# Altium schematic sheet Arena2.0.SchDoc
size A4
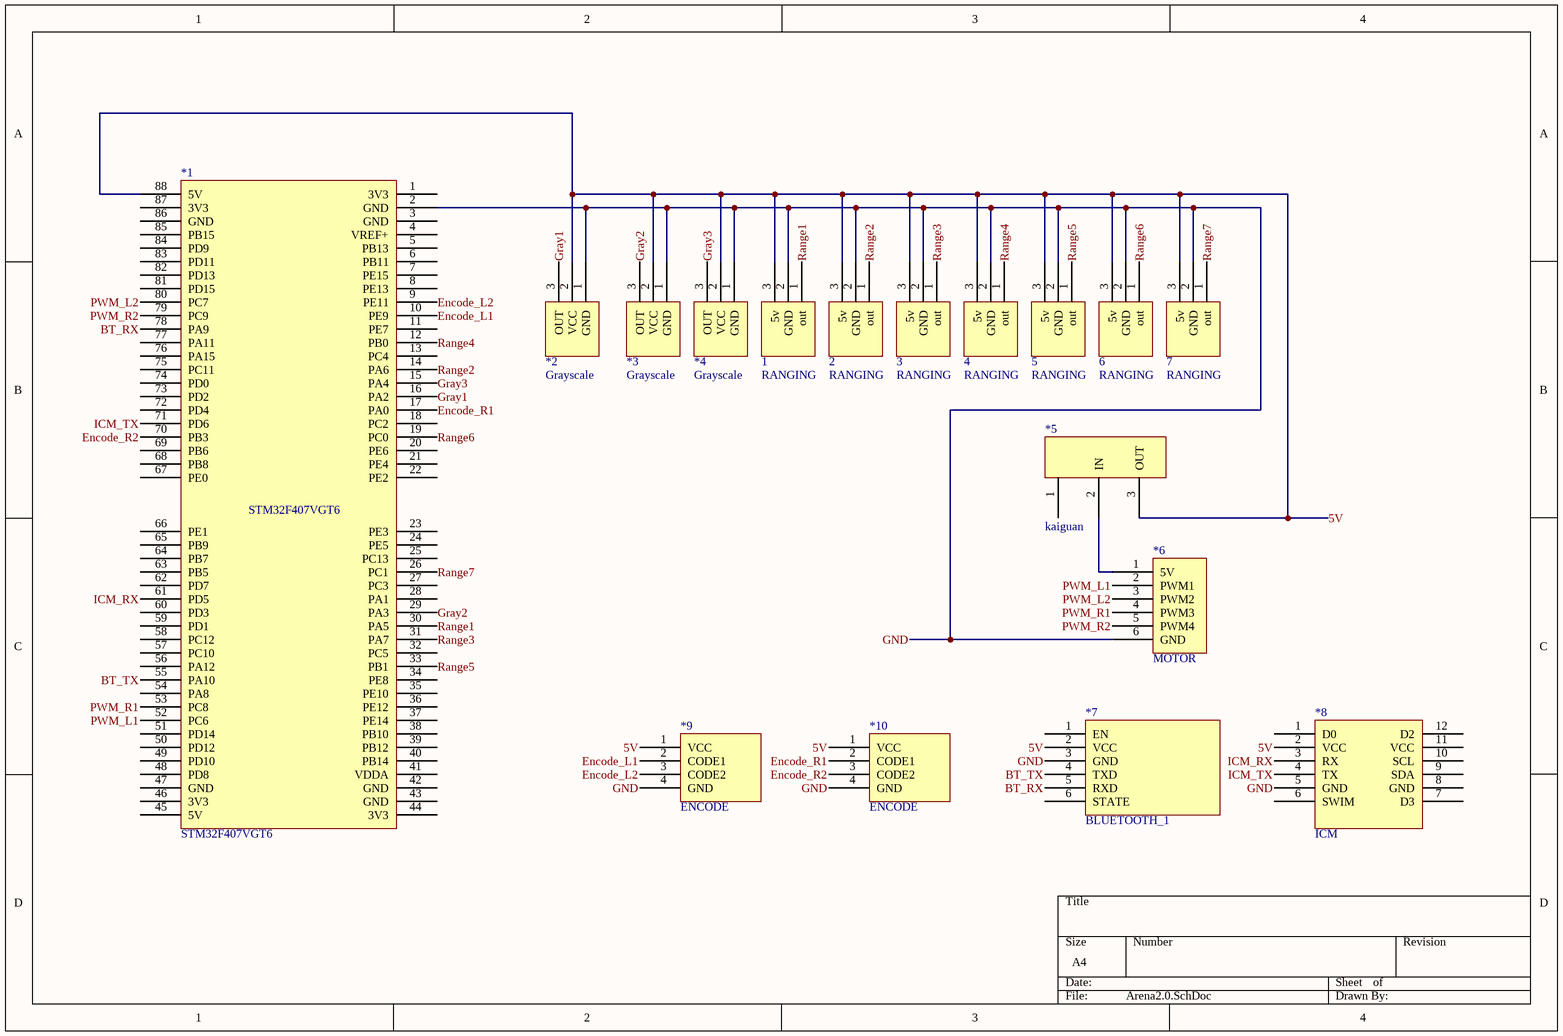
[diagram p0: Arena2.0.SchDoc]

## Parts
1  RANGING  [PH2.0-L-Z-3P]
2  RANGING  [PH2.0-L-Z-3P]
3  RANGING  [PH2.0-L-Z-3P]
4  RANGING  [PH2.0-L-Z-3P]
5  RANGING  [PH2.0-L-Z-3P]
6  RANGING  [PH2.0-L-Z-3P]
7  RANGING  [PH2.0-L-Z-3P]
*1  STM32F407VGT6  [STM32F407VGT6]
*2  Grayscale  [PH2.0-L-Z-3P]
*3  Grayscale  [PH2.0-L-Z-3P]
*4  Grayscale  [PH2.0-L-Z-3P]
*5  kaiguan  [kaiguan]
*6  MOTOR  [PH2.0-L-Z-6P]
*7  BLUETOOTH_1  [bluetooth]
*8  ICM  [ICM]
*9  ENCODE  [PH2.0-L-Z-4P]
*10  ENCODE  [PH2.0-L-Z-4P]

## Nets
5V: 1.3(5v) 2.3(5v) 3.3(5v) 4.3(5v) 5.3(5v) 6.3(5v) 7.3(5v) *1.88(5V) *2.2(VCC) *3.2(VCC) *4.2(VCC) *5.3(OUT) *7.2(VCC) *8.2(VCC) *9.1(VCC) *10.1(VCC)
BT_RX: *1.78(PA9) *7.5(RXD)
BT_TX: *1.55(PA10) *7.4(TXD)
Encode_L1: *1.10(PE9) *9.2(CODE1)
Encode_L2: *1.9(PE11) *9.3(CODE2)
Encode_R1: *1.17(PA0) *10.2(CODE1)
Encode_R2: *1.70(PB3) *10.3(CODE2)
GND: 1.2(GND) 2.2(GND) 3.2(GND) 4.2(GND) 5.2(GND) 6.2(GND) 7.2(GND) *1.2(GND) *2.1(GND) *3.1(GND) *4.1(GND) *6.6(GND) *7.3(GND) *8.5(GND) *9.4(GND) *10.4(GND)
Gray1: *1.16(PA2) *2.3(OUT)
Gray2: *1.29(PA3) *3.3(OUT)
Gray3: *1.15(PA4) *4.3(OUT)
ICM_RX: *1.61(PD5) *8.3(RX)
ICM_TX: *1.71(PD6) *8.4(TX)
PWM_L1: *1.52(PC6) *6.2(PWM1)
PWM_L2: *1.80(PC7) *6.3(PWM2)
PWM_R1: *1.53(PC8) *6.4(PWM3)
PWM_R2: *1.79(PC9) *6.5(PWM4)
Range1: 1.1(out) *1.30(PA5)
Range2: 2.1(out) *1.14(PA6)
Range3: 3.1(out) *1.31(PA7)
Range4: 4.1(out) *1.12(PB0)
Range5: 5.1(out) *1.33(PB1)
Range6: 6.1(out) *1.19(PC0)
Range7: 7.1(out) *1.26(PC1)
Net*5_2: *5.2(IN) *6.1(5V)

Not connected (* = marked no-connect by the designer): *1 1(3V3) 3(GND) 4(VREF+) 5(PB13) 6(PB11) 7(PE15) 8(PE13) 11(PE7) 13(PC4) 18(PC2) 20(PE6) 21(PE4) 22(PE2) 23(PE3) 24(PE5) 25(PC13) 27(PC3) 28(PA1) 32(PC5) 34(PE8) 35(PE10) 36(PE12) 37(PE14) 38(PB10) 39(PB12) 40(PB14) 41(VDDA) 42(GND) 43(GND) 44(3V3) 45(5V) 46(3V3) 47(GND) 48(PD8) 49(PD10) 50(PD12) 51(PD14) 54(PA8) 56(PA12) 57(PC10) 58(PC12) 59(PD1) 60(PD3) 62(PD7) 63(PB5) 64(PB7) 65(PB9) 66(PE1) 67(PE0) 68(PB8) 69(PB6) 72(PD4) 73(PD2) 74(PD0) 75(PC11) 76(PA15) 77(PA11) 81(PD15) 82(PD13) 83(PD11) 84(PD9) 85(PB15) 86(GND) 87(3V3); *5 1; *7 1(EN) 6(STATE); *8 1(D0) 6(SWIM) 7(D3) 8(GND) 9(SDA) 10(SCL) 11(VCC) 12(D2)